# Altium project DimmerAC220V.PrjPcb
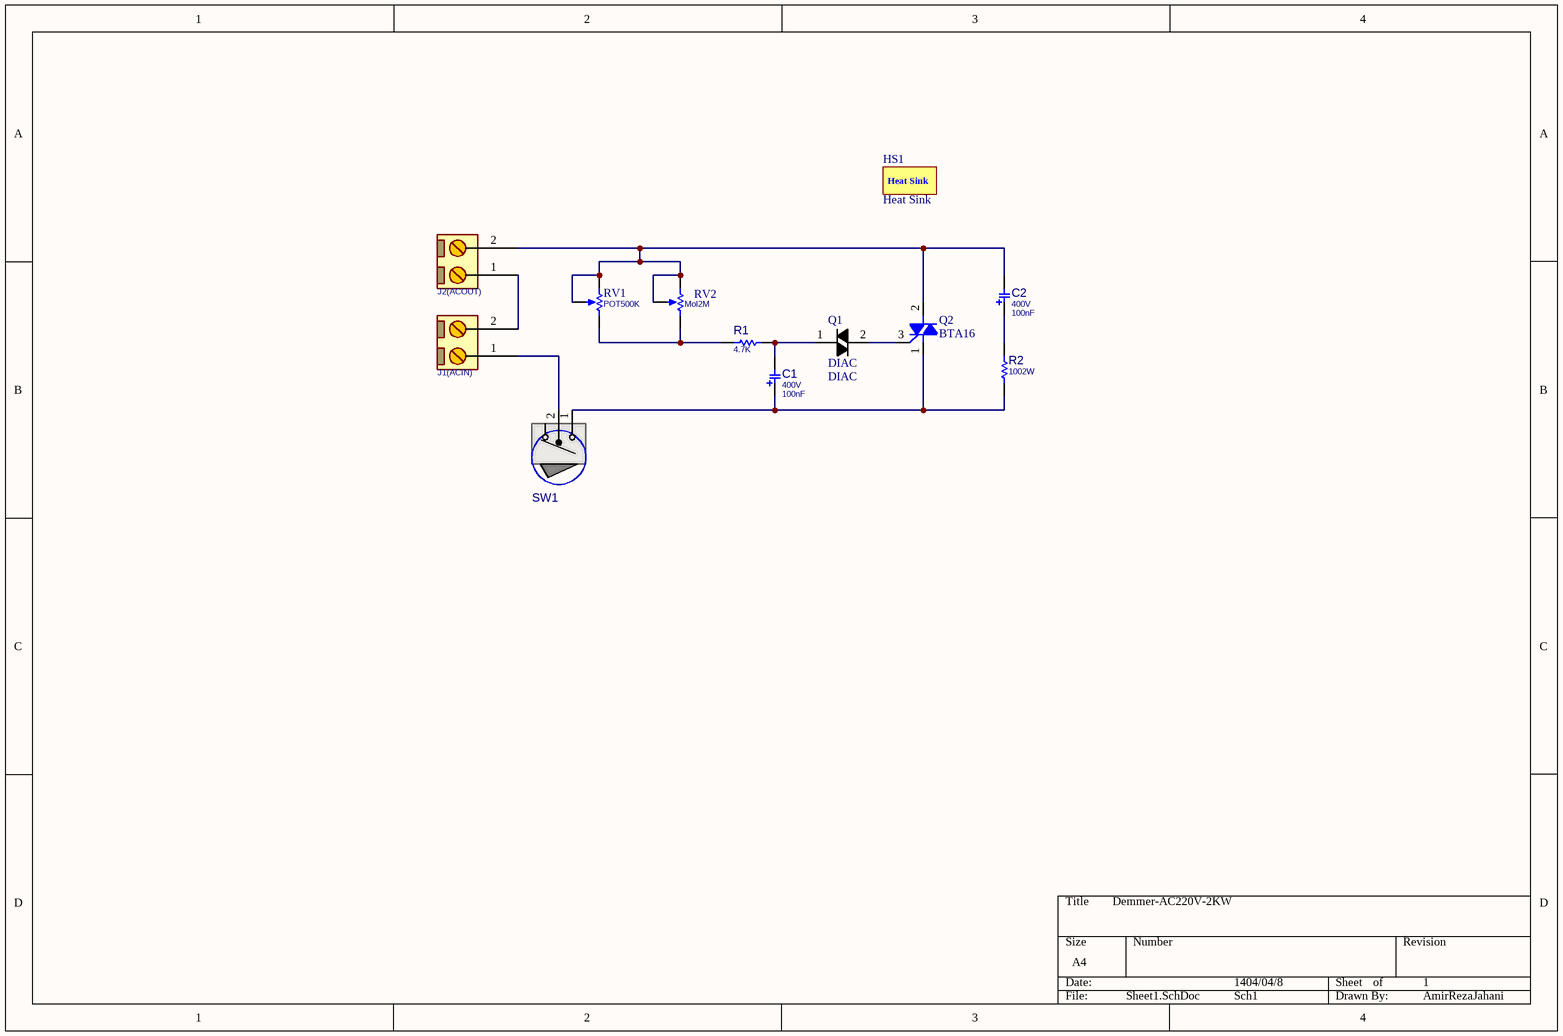
[diagram p0: Sheet1.SchDoc]
1 sheet, 12 parts. Net scope: global (net labels, ports and power ports of the same name join across sheets).
Board file: PCB1.PcbDoc

## Sheet Sheet1.SchDoc
size A4; SheetNumber: 1; SheetTotal: 1

### Parts
C1  PARAM2: 400V  [C_FLM_22X7H14]  (hidden comment: 100nF)
C2  PARAM2: 400V  [C_FLM_22X7H14]  (hidden comment: 100nF)
HS1  Heat Sink  [HeatSink PH51]  (mechanical)
J1(ACIN)  CONN_TB2  [TBG_2]  (value not drawn)
J2(ACOUT)  CONN_TB2  [TBG_2]  (value not drawn)
Q1  DIAC  [D_AX03_DO35]
Q2  BTA16  [TO220_3]
R1  4.7K  [R025W_AX04]
R2  1002W  [R2W_AX08]
RV1  POT500K  [VOL_R]
RV2  Mol2M  [POT_3296W]
SW1  ToggleSwitch  [SWRCK_SPST_S_15X10]  (value not drawn)

### Nets
NetC1_1: C1.1 Q2.1(T1) R2.1 SW1.1(T1)
NetC1_2: C1.2 Q1.1(A1) R1.2
NetC2_1: C2.1 R2.2
NetC2_2: C2.2 J2(ACOUT).2 Q2.2(T2) RV1.1(TOP) RV1.2(TAP) RV2.1(TOP) RV2.2(TAP)
NetJ1(ACIN)_1: J1(ACIN).1 SW1.2(COM)
NetJ1(ACIN)_2: J1(ACIN).2 J2(ACOUT).1
NetQ1_2: Q1.2(A2) Q2.3(G)
NetR1_1: R1.1 RV1.3(BOT) RV2.3(BOT)

### Notes on the sheet
- Demmer-AC220V-2KW
- 1404/04/8
- 1
- Sch1
- AmirRezaJahani

### Library data of the parts
C1 C2 = CAP_THD_FLM_0.33uF_400v: CAP, THD, FILM,; MANF_P#: MANF_PART#; DESC: DESCRIPTION; DIST#: MOUSER; PARAM: 20%; PRICE: 10= 5$; MANF: MANF; ASSEMBLY: ASSEMBLY; VALUE: 100nF
HS1 = HeatSink PH51: PH51 Heatsink
J1(ACIN) J2(ACOUT) = CONN_TB2: CONN, TERMINAL BLOCK, 5.08mm pitch; VALUE: CONN_TB2
Q1 = DIAC_DB3_DO35: Diac, 32VBO, DO-35; MANF_P#: DB3; MANF: ST; PARAM: 2A, -40~125oC; PRICE: toman@PAYA; PARAM2: 32VBO; VALUE: DIAC
Q2 = TRIAC_BTA16-800_TO220: Triac, 800V, 16A, TO-220; MANF_P#: BTA16-800CW; MANF: ST; PRICE: 1200toman@PAYA; VALUE: BTA16
R1 R2 = RES_THD: RESISTOR, THD; MANF_P#: RK73H1ETTP4701F; MANF: KOA SPEER; PARAM: 0.063W; DESC: DESCRIPTION; DIST#: MOUSER; PARAM2: 1%; ASSEMBLY: ASSEMBLY; PRICE: 100= 0.5$
  R1: VALUE: 4.7K
  R2: VALUE: 1002W
RV1 = RES_THD_POT_VOL: RESISTOR, THD, Potentiometer Volume; VALUE: POT500K
RV2 = RES_THD_POT_3296W: RESISTOR, THD, Potentiometer; VALUE: Mol2M
SW1 = SWROK_SPST_R_15X10: SWITCH, Rocker, SPST, THD, 15x10.5mm; DESC: DESCRIPTION; MANF: -; MANF_PART#: -; VALUE: ToggleSwitch; ASSEMBLY: ASSEMBLY; PARAM: -; PRICE: -